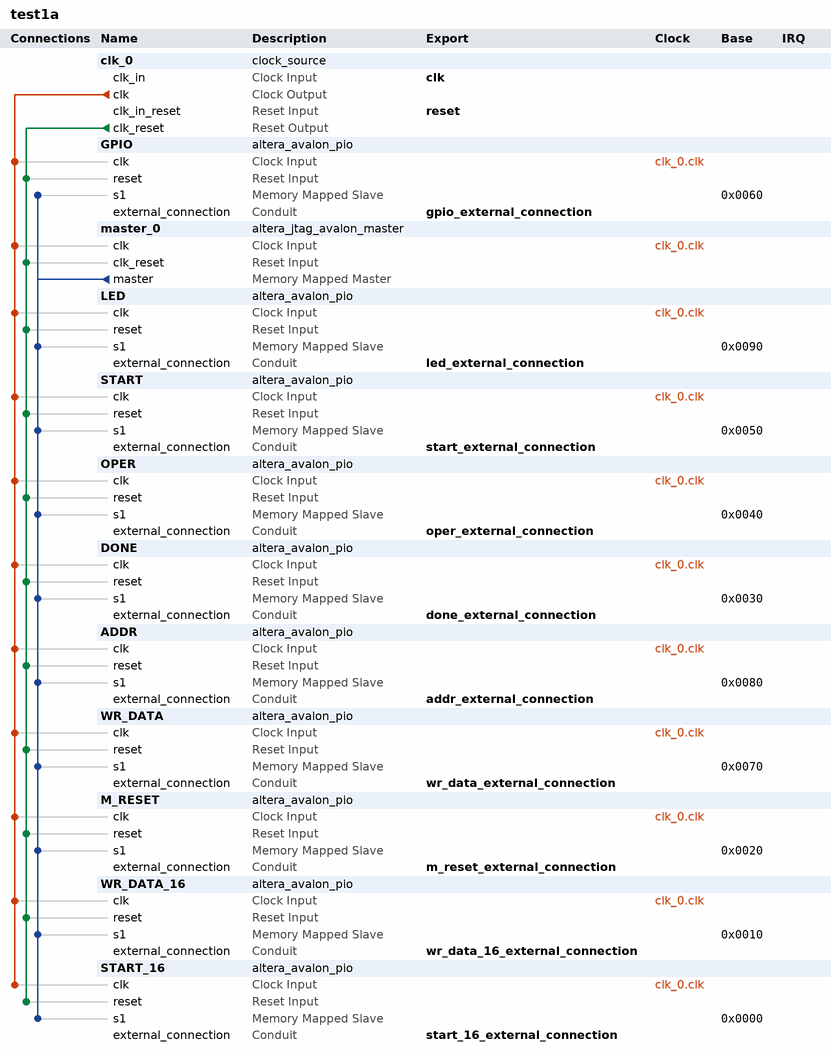
[diagram p0: system contents]
# Platform Designer (Qsys) system test1a, Cyclone V 5CSEMA5F31C6
# Parameters at their usual value, and those the tool derives, are not listed.
package require -exact qsys 17.0
create_system test1a
set_project_property DEVICE_FAMILY {Cyclone V}
set_project_property DEVICE 5CSEMA5F31C6

add_instance clk_0 clock_source 17.0
set_instance_parameter_value clk_0 clockFrequency 50000000

add_instance GPIO altera_avalon_pio 17.0
set_instance_parameter_value GPIO direction Output
set_instance_parameter_value GPIO width 8

add_instance master_0 altera_jtag_avalon_master 17.0

add_instance LED altera_avalon_pio 17.0
set_instance_parameter_value LED direction Output
set_instance_parameter_value LED width 8

add_instance START altera_avalon_pio 17.0
set_instance_parameter_value START direction Output
set_instance_parameter_value START width 1

add_instance OPER altera_avalon_pio 17.0
set_instance_parameter_value OPER direction Output
set_instance_parameter_value OPER width 1

add_instance DONE altera_avalon_pio 17.0
set_instance_parameter_value DONE direction Input
set_instance_parameter_value DONE width 1

add_instance ADDR altera_avalon_pio 17.0
set_instance_parameter_value ADDR direction Output
set_instance_parameter_value ADDR width 8

add_instance WR_DATA altera_avalon_pio 17.0
set_instance_parameter_value WR_DATA direction Output
set_instance_parameter_value WR_DATA width 32

add_instance M_RESET altera_avalon_pio 17.0
set_instance_parameter_value M_RESET direction Output
set_instance_parameter_value M_RESET width 1

add_instance WR_DATA_16 altera_avalon_pio 17.0
set_instance_parameter_value WR_DATA_16 direction Output
set_instance_parameter_value WR_DATA_16 width 16

add_instance START_16 altera_avalon_pio 17.0
set_instance_parameter_value START_16 direction Output
set_instance_parameter_value START_16 width 1

# connections
add_connection clk_0.clk ADDR.clk clock
add_connection clk_0.clk DONE.clk clock
add_connection clk_0.clk GPIO.clk clock
add_connection clk_0.clk LED.clk clock
add_connection clk_0.clk M_RESET.clk clock
add_connection clk_0.clk master_0.clk clock
add_connection clk_0.clk OPER.clk clock
add_connection clk_0.clk START.clk clock
add_connection clk_0.clk START_16.clk clock
add_connection clk_0.clk WR_DATA.clk clock
add_connection clk_0.clk WR_DATA_16.clk clock
add_connection clk_0.clk_reset ADDR.reset reset
add_connection clk_0.clk_reset DONE.reset reset
add_connection clk_0.clk_reset GPIO.reset reset
add_connection clk_0.clk_reset LED.reset reset
add_connection clk_0.clk_reset M_RESET.reset reset
add_connection clk_0.clk_reset master_0.clk_reset reset
add_connection clk_0.clk_reset OPER.reset reset
add_connection clk_0.clk_reset START.reset reset
add_connection clk_0.clk_reset START_16.reset reset
add_connection clk_0.clk_reset WR_DATA.reset reset
add_connection clk_0.clk_reset WR_DATA_16.reset reset
add_connection master_0.master ADDR.s1 avalon
set_connection_parameter_value master_0.master/ADDR.s1 baseAddress 0x0080
add_connection master_0.master DONE.s1 avalon
set_connection_parameter_value master_0.master/DONE.s1 baseAddress 0x0030
add_connection master_0.master GPIO.s1 avalon
set_connection_parameter_value master_0.master/GPIO.s1 baseAddress 0x0060
add_connection master_0.master LED.s1 avalon
set_connection_parameter_value master_0.master/LED.s1 baseAddress 0x0090
add_connection master_0.master M_RESET.s1 avalon
set_connection_parameter_value master_0.master/M_RESET.s1 baseAddress 0x0020
add_connection master_0.master OPER.s1 avalon
set_connection_parameter_value master_0.master/OPER.s1 baseAddress 0x0040
add_connection master_0.master START.s1 avalon
set_connection_parameter_value master_0.master/START.s1 baseAddress 0x0050
add_connection master_0.master START_16.s1 avalon
set_connection_parameter_value master_0.master/START_16.s1 baseAddress 0x0000
add_connection master_0.master WR_DATA.s1 avalon
set_connection_parameter_value master_0.master/WR_DATA.s1 baseAddress 0x0070
add_connection master_0.master WR_DATA_16.s1 avalon
set_connection_parameter_value master_0.master/WR_DATA_16.s1 baseAddress 0x0010

# exported interfaces
add_interface addr_external_connection conduit end
set_interface_property addr_external_connection EXPORT_OF ADDR.external_connection
add_interface clk clock sink
set_interface_property clk EXPORT_OF clk_0.clk_in
add_interface done_external_connection conduit end
set_interface_property done_external_connection EXPORT_OF DONE.external_connection
add_interface gpio_external_connection conduit end
set_interface_property gpio_external_connection EXPORT_OF GPIO.external_connection
add_interface led_external_connection conduit end
set_interface_property led_external_connection EXPORT_OF LED.external_connection
add_interface m_reset_external_connection conduit end
set_interface_property m_reset_external_connection EXPORT_OF M_RESET.external_connection
add_interface oper_external_connection conduit end
set_interface_property oper_external_connection EXPORT_OF OPER.external_connection
add_interface reset reset sink
set_interface_property reset EXPORT_OF clk_0.clk_in_reset
add_interface start_16_external_connection conduit end
set_interface_property start_16_external_connection EXPORT_OF START_16.external_connection
add_interface start_external_connection conduit end
set_interface_property start_external_connection EXPORT_OF START.external_connection
add_interface wr_data_16_external_connection conduit end
set_interface_property wr_data_16_external_connection EXPORT_OF WR_DATA_16.external_connection
add_interface wr_data_external_connection conduit end
set_interface_property wr_data_external_connection EXPORT_OF WR_DATA.external_connection

set_interconnect_requirement {$system} qsys_mm.clockCrossingAdapter HANDSHAKE
set_interconnect_requirement {$system} qsys_mm.enableEccProtection FALSE
set_interconnect_requirement {$system} qsys_mm.insertDefaultSlave FALSE
set_interconnect_requirement {$system} qsys_mm.maxAdditionalLatency 1

save_system test1a.qsys
